# Altium schematic sheet root.SchDoc
size A4
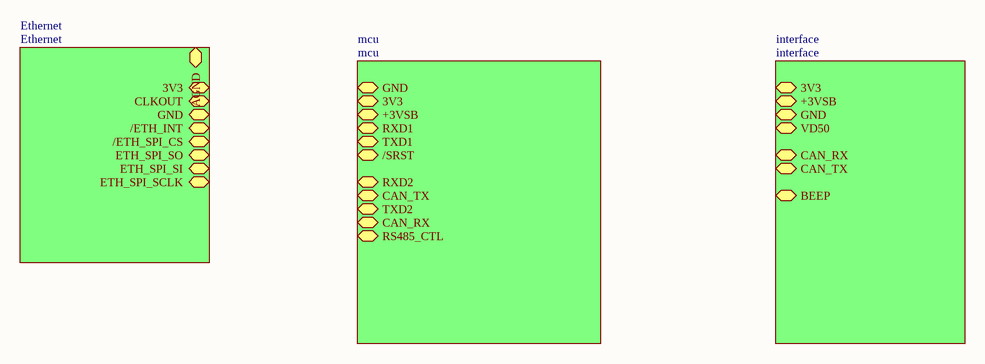
[diagram p0: root.SchDoc]

## Sub-sheets
Ethernet = Ethernet: 3V3, CLKOUT, GND, /ETH_INT, /ETH_SPI_CS, ETH_SPI_SO, ETH_SPI_SI, ETH_SPI_SCLK, AGND
interface = interface: 3V3, +3VSB, GND, VD50, CAN_RX, BEEP, CAN_TX
mcu = mcu: GND, 3V3, +3VSB, RXD1, TXD1, /SRST, RXD2, CAN_TX, TXD2, CAN_RX, RS485_CTL